# Altium schematic sheet OUT.SchDoc
size Letter
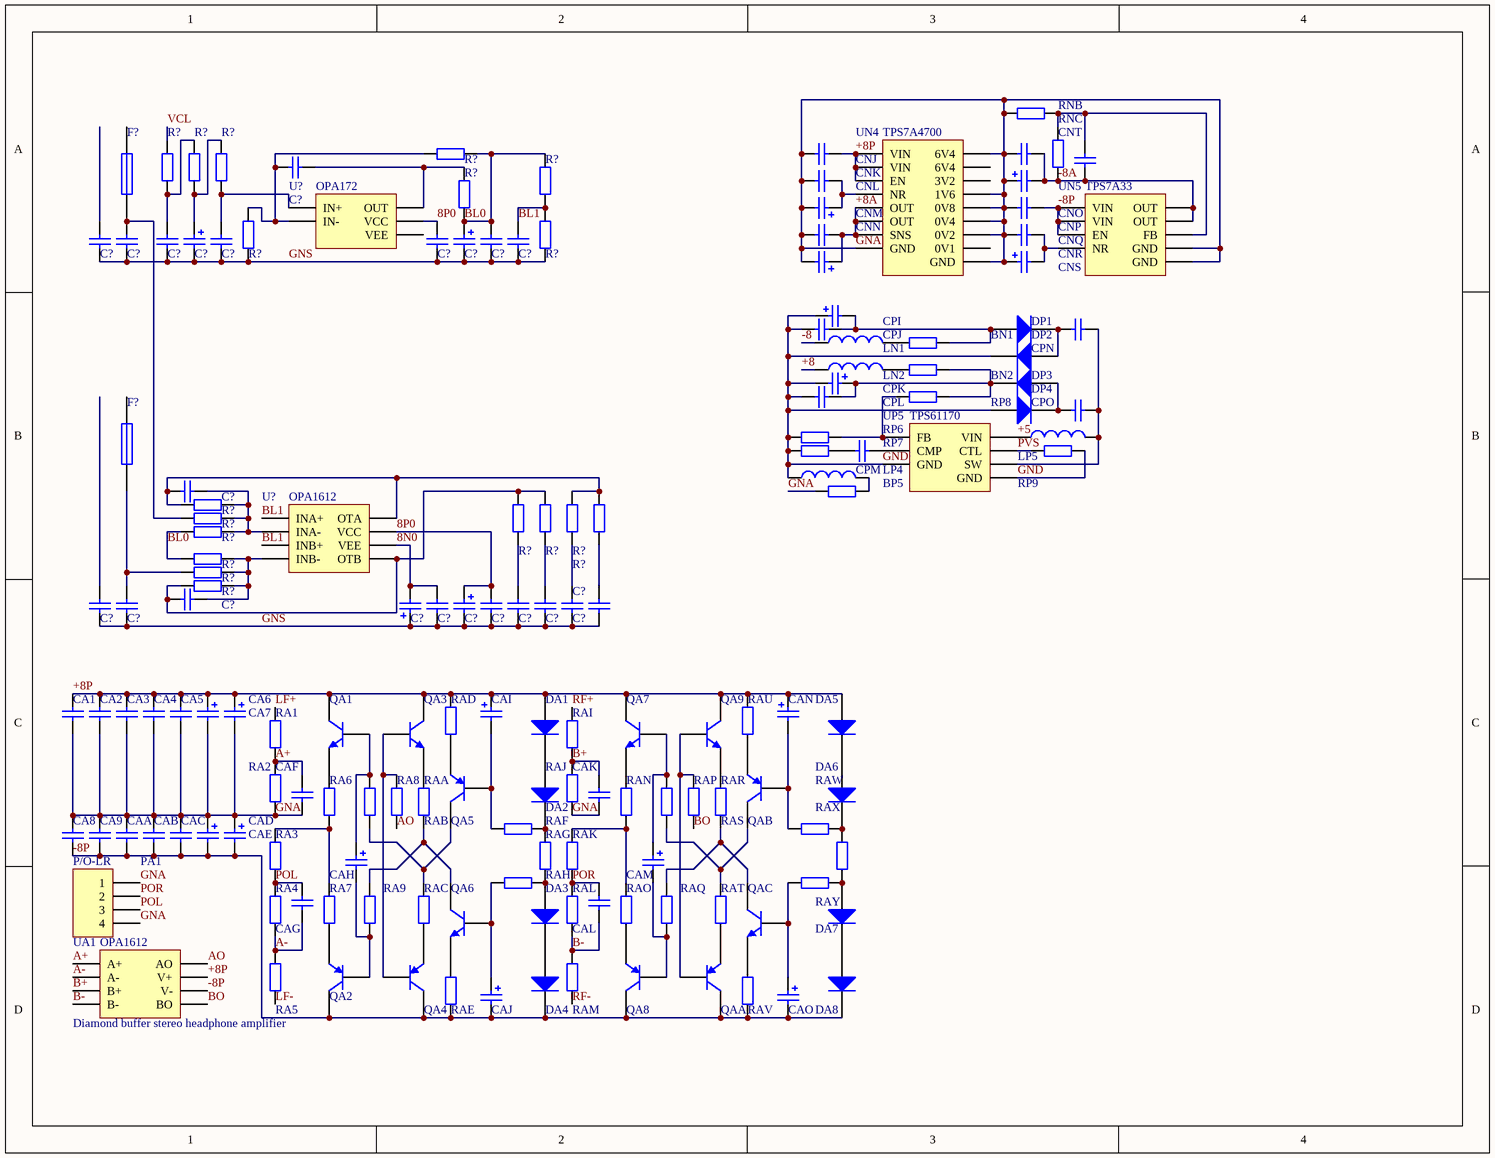
[diagram p0: OUT.SchDoc]

## Parts
(Parts that share a designator on the sheet are numbered #1, #2 ... from top to bottom, then left to right.)
BN1  Res2  [0603]  (value not drawn)
BN2  Res2  [0603]  (value not drawn)
BP5  Res2  [0603]  (value not drawn)
C?#1  Cap  [0402]  (value not drawn)
C?#2  Cap Pol2  [0805]  (value not drawn)
C?#3  Cap Pol2  [0805]  (value not drawn)
C?#4  Cap  [0402]  (value not drawn)
C?#5  Cap  [0402]  (value not drawn)
C?#6  Cap  [0402]  (value not drawn)
C?#7  Cap  [0402]  (value not drawn)
C?#8  Cap  [0402]  (value not drawn)
C?#9  Cap  [0402]  (value not drawn)
C?#10  Cap  [0402]  (value not drawn)
C?#11  Cap  [0402]  (value not drawn)
C?#12  Cap Pol2  [0805]  (value not drawn)
C?#13  Cap  [0402]  (value not drawn)
C?#14  Cap  [0402]  (value not drawn)
C?#15  Cap  [0402]  (value not drawn)
C?#16  Cap Pol2  [0805]  (value not drawn)
C?#17  Cap  [0402]  (value not drawn)
C?#18  Cap  [0402]  (value not drawn)
C?#19  Cap  [0402]  (value not drawn)
C?#20  Cap  [0402]  (value not drawn)
C?#21  Cap  [0402]  (value not drawn)
C?#22  Cap  [0402]  (value not drawn)
CA1  Cap  [0805]  (value not drawn)
CA2  Cap  [0805]  (value not drawn)
CA3  Cap  [0805]  (value not drawn)
CA4  Cap  [0805]  (value not drawn)
CA5  Cap  [0805]  (value not drawn)
CA6  Cap Pol2  [1206]  (value not drawn)
CA7  Cap Pol2  [1206]  (value not drawn)
CA8  Cap  [0805]  (value not drawn)
CA9  Cap  [0805]  (value not drawn)
CAA  Cap  [0805]  (value not drawn)
CAB  Cap  [0805]  (value not drawn)
CAC  Cap  [0805]  (value not drawn)
CAD  Cap Pol2  [1206]  (value not drawn)
CAE  Cap Pol2  [1206]  (value not drawn)
CAF  Cap  [0402]  (value not drawn)
CAG  Cap  [0402]  (value not drawn)
CAH  Cap Pol2  [0805]  (value not drawn)
CAI  Cap Pol2  [0805]  (value not drawn)
CAJ  Cap Pol2  [0805]  (value not drawn)
CAK  Cap  [0402]  (value not drawn)
CAL  Cap  [0402]  (value not drawn)
CAM  Cap Pol2  [0805]  (value not drawn)
CAN  Cap Pol2  [0805]  (value not drawn)
CAO  Cap Pol2  [0805]  (value not drawn)
CNJ  Cap  [0805]  (value not drawn)
CNK  Cap  [0805]  (value not drawn)
CNL  Cap Pol2  [0805]  (value not drawn)
CNM  Cap  [0805]  (value not drawn)
CNN  Cap Pol2  [1206]  (value not drawn)
CNO  Cap  [0805]  (value not drawn)
CNP  Cap Pol2  [1206]  (value not drawn)
CNQ  Cap  [0805]  (value not drawn)
CNR  Cap  [0805]  (value not drawn)
CNS  Cap Pol2  [0805]  (value not drawn)
CNT  Cap  [0402]  (value not drawn)
CPI  Cap Pol2  [1206]  (value not drawn)
CPJ  Cap  [0805]  (value not drawn)
CPK  Cap Pol2  [1206]  (value not drawn)
CPL  Cap  [0805]  (value not drawn)
CPM  Cap  [0402]  (value not drawn)
CPN  Cap  [0402]  (value not drawn)
CPO  Cap  [0402]  (value not drawn)
DA1  Diode  [SOD882]  (value not drawn)
DA2  Diode  [SOD882]  (value not drawn)
DA3  Diode  [SOD882]  (value not drawn)
DA4  Diode  [SOD882]  (value not drawn)
DA5  Diode  [SOD882]  (value not drawn)
DA6  Diode  [SOD882]  (value not drawn)
DA7  Diode  [SOD882]  (value not drawn)
DA8  Diode  [SOD882]  (value not drawn)
DP1  Diode  [SOD882]  (value not drawn)
DP2  Diode  [SOD882]  (value not drawn)
DP3  Diode  [SOD882]  (value not drawn)
DP4  Diode  [SOD882]  (value not drawn)
F?#1  Fuse 1  [0402]  (value not drawn)
F?#2  Fuse 1  [0402]  (value not drawn)
LN1  Inductor  [SRP2010]  (value not drawn)
LN2  Inductor  [SRP2010]  (value not drawn)
LP4  Inductor  [SRP2010]  (value not drawn)
LP5  Inductor  [SRP2010]  (value not drawn)
PA1  P/O-LR  [HDR1X4]
QA1  NPN  [SOT23]  (value not drawn)
QA2  PNP  [SOT23]  (value not drawn)
QA3  NPN  [SOT23]  (value not drawn)
QA4  PNP  [SOT23]  (value not drawn)
QA5  PNP  [SOT23]  (value not drawn)
QA6  NPN  [SOT23]  (value not drawn)
QA7  NPN  [SOT23]  (value not drawn)
QA8  PNP  [SOT23]  (value not drawn)
QA9  NPN  [SOT23]  (value not drawn)
QAA  PNP  [SOT23]  (value not drawn)
QAB  PNP  [SOT23]  (value not drawn)
QAC  NPN  [SOT23]  (value not drawn)
R?#1  Res2  [0402]  (value not drawn)
R?#2  Res2  [0402]  (value not drawn)
R?#3  Res2  [0402]  (value not drawn)
R?#4  Res2  [0402]  (value not drawn)
R?#5  Res2  [0402]  (value not drawn)
R?#6  Res2  [0402]  (value not drawn)
R?#7  Res2  [0402]  (value not drawn)
R?#8  Res2  [0402]  (value not drawn)
R?#9  Res2  [0402]  (value not drawn)
R?#10  Res2  [0402]  (value not drawn)
R?#11  Res2  [0402]  (value not drawn)
R?#12  Res2  [0402]  (value not drawn)
R?#13  Res2  [0402]  (value not drawn)
R?#14  Res2  [0402]  (value not drawn)
R?#15  Res2  [0402]  (value not drawn)
R?#16  Res2  [0402]  (value not drawn)
R?#17  Res2  [0402]  (value not drawn)
R?#18  Res2  [0402]  (value not drawn)
RA1  Res2  [0402]  (value not drawn)
RA2  Res2  [0402]  (value not drawn)
RA3  Res2  [0402]  (value not drawn)
RA4  Res2  [0402]  (value not drawn)
RA5  Res2  [0402]  (value not drawn)
RA6  Res2  [0402]  (value not drawn)
RA7  Res2  [0402]  (value not drawn)
RA8  Res2  [0402]  (value not drawn)
RA9  Res2  [0402]  (value not drawn)
RAA  Res2  [0402]  (value not drawn)
RAB  Res2  [0402]  (value not drawn)
RAC  Res2  [0402]  (value not drawn)
RAD  Res2  [0402]  (value not drawn)
RAE  Res2  [0402]  (value not drawn)
RAF  Res2  [0402]  (value not drawn)
RAG  Res2  [0402]  (value not drawn)
RAH  Res2  [0402]  (value not drawn)
RAI  Res2  [0402]  (value not drawn)
RAJ  Res2  [0402]  (value not drawn)
RAK  Res2  [0402]  (value not drawn)
RAL  Res2  [0402]  (value not drawn)
RAM  Res2  [0402]  (value not drawn)
RAN  Res2  [0402]  (value not drawn)
RAO  Res2  [0402]  (value not drawn)
RAP  Res2  [0402]  (value not drawn)
RAQ  Res2  [0402]  (value not drawn)
RAR  Res2  [0402]  (value not drawn)
RAS  Res2  [0402]  (value not drawn)
RAT  Res2  [0402]  (value not drawn)
RAU  Res2  [0402]  (value not drawn)
RAV  Res2  [0402]  (value not drawn)
RAW  Res2  [0402]  (value not drawn)
RAX  Res2  [0402]  (value not drawn)
RAY  Res2  [0402]  (value not drawn)
RNB  Res2  [0402]  (value not drawn)
RNC  Res2  [0402]  (value not drawn)
RP6  Res2  [0402]  (value not drawn)
RP7  Res2  [0402]  (value not drawn)
RP8  Res2  [0402]  (value not drawn)
RP9  Res2  [0402]  (value not drawn)
U?#1  OPA172  [SC705]
U?#2  OPA1612  [SON8]
UA1  OPA1612  [SON8]
UN4  TPS7A4700  [QFN20]
UN5  TPS7A33  [QFN20]
UP5  TPS61170  [WSON6]

## Nets
8N0: C?#16.2 C?#17.2 U?#2.4(VEE)
8P0: C?#8.2 C?#12.1 C?#18.2 U?#1.5(VCC) U?#2.8(VCC)
+5: LP5.1 UP5.6(VIN)
+8: LN2.1
+8A: CNM.1 CNN.1 UN4.1(OUT) UN4.3(SNS) UN4.20(OUT)
+8P: CA1.1 CA2.1 CA3.1 CA4.1 CA5.1 CA6.1 CA7.1 CAI.1 CAN.1 CNJ.1 DA1.1(A) DA5.1(A) QA1.1(C) QA3.1(C) QA7.1(C) QA9.1(C) RAD.2 RAU.2 UA1.8(V+) UN4.13(EN) UN4.15(VIN) UN4.16(VIN)
-8: LN1.1
-8A: CNO.1 CNP.2 CNT.1 RNC.2 UN5.1(OUT) UN5.20(OUT)
-8P: CA8.2 CA9.2 CAA.2 CAB.2 CAC.2 CAD.2 CAE.2 CAJ.2 CAO.2 CNQ.2 DA4.2(K) DA8.2(K) QA2.1(C) QA4.1(C) QA8.1(C) QAA.1(C) RAE.2 RAV.2 UA1.4(V-) UN5.13(EN) UN5.15(VIN) UN5.16(VIN)
A+: CAF.1 RA1.2 RA2.1 UA1.3(A+)
A-: CAG.2 RA4.2 RA5.1 UA1.2(A-)
AO: RAA.2 UA1.1(AO)
B+: CAK.1 RAI.2 RAJ.1 UA1.5(B+)
B-: CAL.2 RAL.2 RAM.1 UA1.6(B-)
BL0: C?#3.1 C?#9.2 R?#4.1 R?#5.1 R?#6.2 R?#15.2 R?#16.2
BL1: C?#10.2 R?#5.2 R?#8.1 U?#2.3(INA+) U?#2.5(INB+)
BO: RAR.2 UA1.7(BO)
GNA: BP5.1 CA1.2 CA2.2 CA3.2 CA4.2 CA5.2 CA6.2 CA7.2 CA8.1 CA9.1 CAA.1 CAB.1 CAC.1 CAD.1 CAE.1 CAF.2 CAK.2 CNJ.2 CNK.2 CNL.2 CNM.2 CNN.2 CNO.2 CNP.1 CNQ.1 CNR.1 CNS.1 PA1.1 PA1.4 RA2.2 RAJ.2 RNB.2 UN4.4(6V4) UN4.7(GND) UN4.8(1V6) UN4.9(0V8) UN4.10(0V4) UN4.11(0V2) UN4.21(GND) UN5.7(GND) UN5.21(GND)
GND: CPI.1 CPJ.2 CPK.2 CPL.2 DP2.2(K) DP4.1(A) LP4.1 RP6.2 RP7.2 RP9.1 UP5.3(GND) UP5.7(GND)
GNS: C?#2.2 C?#3.2 C?#4.1 C?#5.1 C?#6.1 C?#7.1 C?#8.1 C?#9.1 C?#10.1 C?#12.2 C?#13.1 C?#14.1 C?#16.1 C?#17.1 C?#18.1 C?#19.1 C?#20.1 C?#21.1 C?#22.1 R?#7.2 R?#8.2
LF+: RA1.1
LF-: RA5.2
POL: CAG.1 PA1.3 RA3.1 RA4.1
POR: CAL.1 PA1.2 RAK.1 RAL.1
PVS: RP9.2 UP5.5(CTL)
RF+: RAI.1
RF-: RAM.2
VCL: R?#1.1
NetBN1_1: BN1.1 CPI.2 CPJ.1 DP1.1(A)
NetBN1_2: BN1.2 LN1.2
NetBN2_1: BN2.1 CPK.1 CPL.1 DP3.2(K) RP8.1
NetBN2_2: BN2.2 LN2.2
NetBP5_2: BP5.2 LP4.2
NetC?#1_1: C?#1.1 R?#6.1 U?#1.1(OUT)
NetC?#1_2: C?#1.2 R?#4.2 R?#7.1 U?#1.4(IN-)
NetC?#2_1: C?#2.1 R?#2.2 R?#3.1
NetC?#5_2: C?#5.2 F?#1.1 R?#14.2
NetC?#6_2: C?#6.2 R?#1.2 R?#2.1
NetC?#7_2: C?#7.2 R?#3.2 U?#1.3(IN+)
NetC?#11_1: C?#11.1 R?#13.1 R?#14.1 R?#15.1 U?#2.2(INA-)
NetC?#11_2: C?#11.2 R?#11.1 R?#12.1 R?#13.2 U?#2.1(OTA)
NetC?#14_2: C?#14.2 F?#2.1 R?#17.2
NetC?#15_1: C?#15.1 R?#16.1 R?#17.1 R?#18.1 U?#2.6(INB-)
NetC?#15_2: C?#15.2 R?#9.1 R?#10.1 R?#18.2 U?#2.7(OTB)
NetC?#19_2: C?#19.2 R?#9.2
NetC?#20_2: C?#20.2 R?#10.2
NetC?#21_2: C?#21.2 R?#11.2
NetC?#22_2: C?#22.2 R?#12.2
NetCAH_1: CAH.1 QA1.2(B) RA8.2
NetCAH_2: CAH.2 QA2.2(B) RA9.1
NetCAI_2: CAI.2 QA5.2(B) RAF.2
NetCAJ_1: CAJ.1 QA6.2(B) RAH.2
NetCAM_1: CAM.1 QA7.2(B) RAP.2
NetCAM_2: CAM.2 QA8.2(B) RAQ.1
NetCAN_2: CAN.2 QAB.2(B) RAW.2
NetCAO_1: CAO.1 QAC.2(B) RAY.2
NetCNK_1: CNK.1 CNL.1 UN4.14(NR)
NetCNR_2: CNR.2 CNS.2 UN5.14(NR)
NetCNT_2: CNT.2 RNB.1 RNC.1 UN5.3(FB)
NetCPM_1: CPM.1 UP5.2(CMP)
NetCPM_2: CPM.2 RP7.1
NetCPN_1: CPN.1 DP1.2(K) DP2.1(A)
NetCPN_2: CPN.2 CPO.2 LP5.2 UP5.4(SW)
NetCPO_1: CPO.1 DP3.1(A) DP4.2(K)
NetDA1_2: DA1.2(K) DA2.1(A)
NetDA2_2: DA2.2(K) RAF.1 RAG.1
NetDA3_1: DA3.1(A) RAG.2 RAH.1
NetDA3_2: DA3.2(K) DA4.1(A)
NetDA5_2: DA5.2(K) DA6.1(A)
NetDA6_2: DA6.2(K) RAW.1 RAX.1
NetDA7_1: DA7.1(A) RAX.2 RAY.1
NetDA7_2: DA7.2(K) DA8.1(A)
NetQA1_3: QA1.3(E) RA6.2
NetQA2_3: QA2.3(E) RA7.1
NetQA3_2: QA3.2(B) QA4.2(B) RAA.1
NetQA3_3: QA3.3(E) RAB.1
NetQA4_3: QA4.3(E) RAC.2
NetQA5_1: QA5.1(C) RA8.1 RAC.1
NetQA5_3: QA5.3(E) RAD.1
NetQA6_1: QA6.1(C) RA9.2 RAB.2
NetQA6_3: QA6.3(E) RAE.1
NetQA7_3: QA7.3(E) RAN.2
NetQA8_3: QA8.3(E) RAO.1
NetQA9_2: QA9.2(B) QAA.2(B) RAR.1
NetQA9_3: QA9.3(E) RAS.1
NetQAA_3: QAA.3(E) RAT.2
NetQAB_1: QAB.1(C) RAP.1 RAT.1
NetQAB_3: QAB.3(E) RAU.1
NetQAC_1: QAC.1(C) RAQ.2 RAS.2
NetQAC_3: QAC.3(E) RAV.1
NetRA3_2: RA3.2 RA6.1 RA7.2
NetRAK_2: RAK.2 RAN.1 RAO.2
NetRP6_1: RP6.1 RP8.2 UP5.1(FB)

Not connected (* = marked no-connect by the designer): C?#4 2; C?#13 2; F?#1 2; F?#2 2; U?#1 2(VEE); UN4 5(6V4) 6(3V2) 12(0V1)

## Notes on the sheet
- (near UA1) Diamond buffer stereo headphone amplifier

## Library data of the parts
BN1 BN2 BP5 R?#1-R?#18 RA1-RA9 RAA RAB RAC RAD RAE RAF RAG RAH RAI RAJ RAK RAL RAM RAN RAO RAP RAQ RAR RAS RAT RAU RAV RAW RAX RAY RNB RNC RP6-RP9 = Res2: Resistor; Value: 1K; Published: 8-Jun-2000; LatestRevisionDate: 17-Jul-2002; LatestRevisionNote: Re-released for DXP Platform.; PackageReference: AXIAL-0.4; Publisher: Altium Limited; PackageDescription: Axial Device, Thru-Hole; 2 Leads; 0.4 in Pin Spacing
C?#1 C?#4-C?#11 C?#13-C?#15 C?#17-C?#22 CA1-CA5 CA8 CA9 CAA CAB CAC CAF CAG CAK CAL CNJ CNK CNM CNO CNQ CNR CNT CPJ CPL CPM CPN CPO = Cap: Capacitor; Value: 100pF; Published: 8-Jun-2000; LatestRevisionDate: 17-Jul-2002; LatestRevisionNote: Re-released for DXP Platform.; PackageReference: RAD-0.3; Publisher: Altium Limited; PackageDescription: Radial Cap, Thru-Hole; 2 Leads; 0.3 in Pin Spacing
C?#2 C?#3 C?#12 C?#16 CA6 CA7 CAD CAE CAH CAI CAJ CAM CAN CAO CNL CNN CNP CNS CPI CPK = Cap Pol2: Polarized Capacitor (Axial); Value: 100pF; Published: 8-Jun-2000; LatestRevisionDate: 17-Jul-2002; LatestRevisionNote: Re-released for DXP Platform.; PackageReference: POLAR0.8; Publisher: Altium Limited; PackageDescription: Polarized Capacitor; 2 Leads
DA1-DA8 DP1-DP4 = Diode: Default Diode; Published: 8-Jun-2000; LatestRevisionDate: 17-Jul-2002; LatestRevisionNote: Re-released for DXP Platform.; PackageVersion: Sep-1996; PackageReference: SMC; Publisher: Altium Limited; PackageDescription: DO-214-AB/SMC; 2 C-Bend Leads; Body 7.9 x 5.9 mm, inc. leads (LxW); Code_JEDEC: DO-214-AB
F?#1 F?#2 = Fuse 1: Fuse; Published: 8-Jun-2000; LatestRevisionDate: 17-Jul-2002; LatestRevisionNote: Re-released for DXP Platform.; PackageReference: PIN-W2/E2.8; Publisher: Altium Limited; PackageDescription: Thru-Hole; 2 Leads
LN1 LN2 LP4 LP5 = Inductor: Code_IEC: 1005; Value: 10mH; Published: 8-Jun-2000; LatestRevisionDate: 29-May-2009; LatestRevisionNote: IPC-7351 Footprint Added.; PackageReference: 0402-A; Publisher: Altium Limited; PackageDescription: Chip Inductor; Code_JEITA: 0402
PA1 = Header 4: Header, 4-Pin; LatestRevisionDate: 17-Jul-2002; LatestRevisionNote: Re-released for DXP Platform.; Publisher: Altium Limited
QA1 QA3 QA6 QA7 QA9 QAC = NPN: NPN Bipolar Transistor; Published: 8-Jun-2000; LatestRevisionDate: 17-Jul-2002; LatestRevisionNote: Re-released for DXP Platform.; PackageReference: TO-226-AA; Publisher: Altium Limited; PackageDescription: TO, Flat Index; 3 In-Line, Axial Leads; Body Dia. 4.8mm; Leads 0.55 x 0.51 mm (max); Code_JEDEC: TO-226-AA
QA2 QA4 QA5 QA8 QAA QAB = PNP: PNP Bipolar Transistor; Published: 8-Jun-2000; LatestRevisionDate: 29-May-2009; LatestRevisionNote: IPC-7351 Footprint Added.; PackageVersion: Aug-1999; PackageReference: SOT-23B; Publisher: Altium Limited; PackageDescription: 3-Pin SOT-23 Package 0.95 mm Pitch, 2.4 mm Lead Span